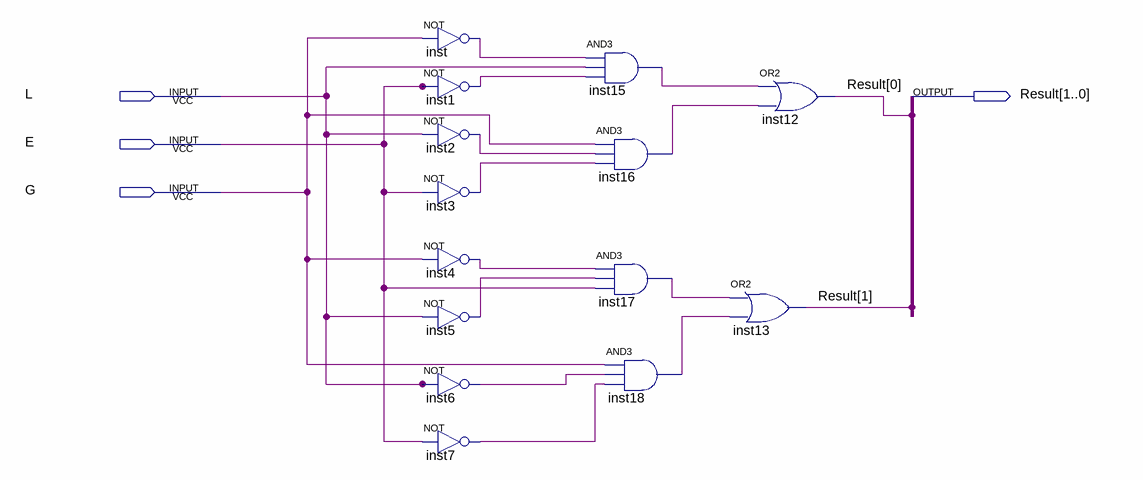
[diagram p0: schematic sheet]
// Quartus schematic Result_decoder.bdf as structural Verilog: 14 symbols, 4 pins
module Result_decoder (
  input  L,
  input  E,
  input  G,
  output [1:0] Result
);

  wire inst1_out, inst2_out, inst3_out, inst4_out, inst5_out, inst6_out, inst7_out, inst15_out, inst16_out,
       inst17_out, inst18_out, inst_out;

  not inst (inst_out, G);
  not inst1 (inst1_out, E);
  not inst2 (inst2_out, L);
  not inst3 (inst3_out, E);
  not inst4 (inst4_out, G);
  not inst5 (inst5_out, L);
  not inst6 (inst6_out, L);
  not inst7 (inst7_out, E);
  and inst15 (inst15_out, inst_out, L, inst1_out);
  and inst16 (inst16_out, G, inst2_out, inst3_out);
  and inst17 (inst17_out, inst4_out, inst5_out, E);
  and inst18 (inst18_out, G, inst6_out, inst7_out);
  or inst12 (Result[0], inst15_out, inst16_out);
  or inst13 (Result[1], inst17_out, inst18_out);
endmodule
